# Altium schematic sheet Memory.SchDoc
size 209 x 297 mm; Author: Мурашкин Д.В.; Address1: Address1; Address2: Address2; Address3: Address3; Address4: Address4; DocumentNumber: SS19946-01; Scale: 1:1; Letter1Column: Э; PartName: Память ПЗУ
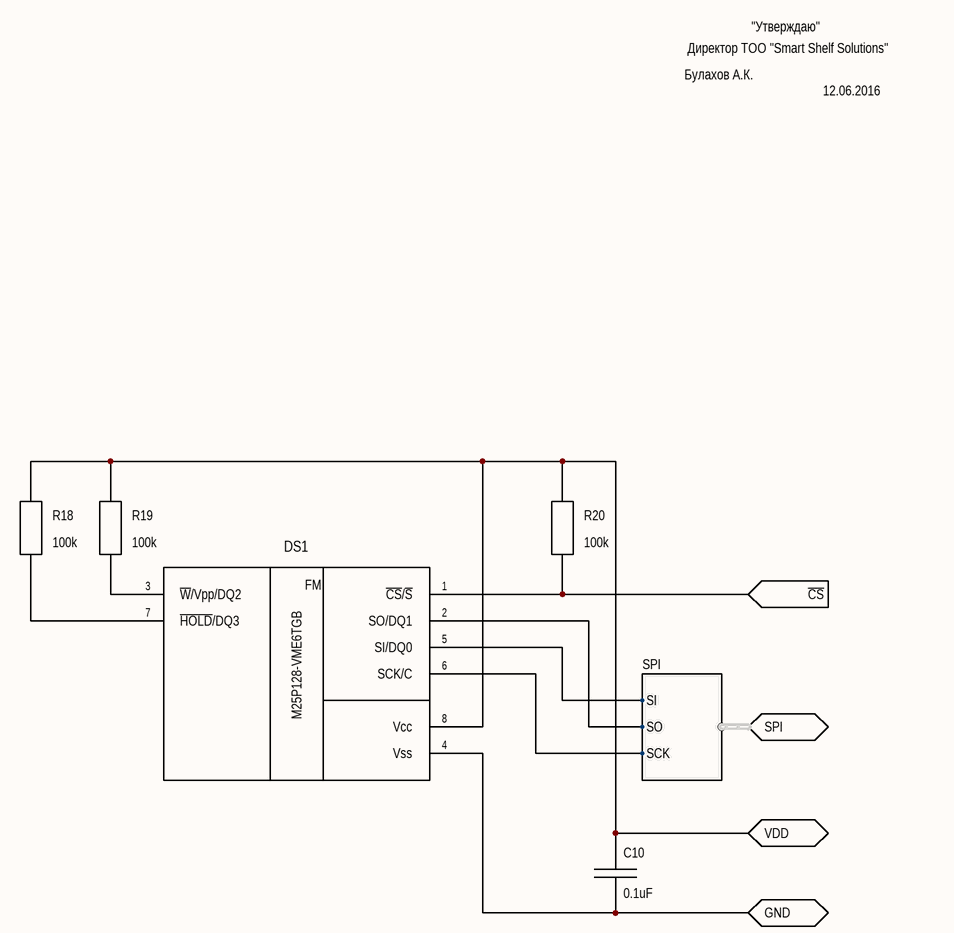
[diagram p0: Memory.SchDoc]

## Parts
C10  0.1uF  [CAPC1608L]
DS1  M25P128-VME6TGB  [VDFPN-8 (8x6)]
R18  100k  [RESC1608L]
R19  100k  [RESC1608L]
R20  100k  [RESC1608L]

## Ports
GND, SPI (harness SPI), VDD, ~{CS} (in)

## Harnesses
SPI: SI, SO, SCK

## Nets
~{CS}: DS1.1(~{CS}/~{S}) R20.2 ; port ~{CS}
GND: C10.2 DS1.4(Vss) ; port GND
VDD: C10.1 DS1.8(Vcc) R18.1 R19.1 R20.1 ; port VDD
NetDS1_2: DS1.2(SO/DQ1) ; port SPI.SO
NetDS1_3: DS1.3(~{W}/Vpp/DQ2) R19.2
NetDS1_5: DS1.5(SI/DQ0) ; port SPI.SI
NetDS1_6: DS1.6(SCK/C) ; port SPI.SCK
NetDS1_7: DS1.7(~{HOLD}/DQ3) R18.2

## Notes on the sheet
- Булахов А.К.
- "Утверждаю"
- Директор ТОО "Smart Shelf Solutions"
- 12.06.2016
- Перв. примен.
- Справ. №
- Подп. и дата
- Инв. № дубл.
- Взам. инв. №
- Разраб.
- Изм.
- Лист
- № докум.
- Подп.
- Дата
- Лит.
- Масса
- Масштаб
- Пров.
- Т.контр.
- Листов
- Инв. № подл.
- Утв.
- Н.контр.
- 2.106-A4
- Копировал
- Формат А4
- (in symbol M25P128-VME6TGB) FM

## Library data of the parts
C10 = CC0603KRX7R8BB104: Capacitor Ceramic 0.1uF 25V; Manufacturer: Yageo; Group: Ceramic Capacitors; Temperature Coefficient: X7R; Tolerance: ±10%; Short description: CAP CER 0.1UF 25V X7R 0603; Type: Ceramic; Part name: CC0603KRX7R8BB104; Voltage: 25 V; Package: 1608; Value: 0.1uF
DS1 = M25P128-VME6TGB: Memory Flash 128M (16M x 8); Manufacturer: Micron Technology; Short description: IC FLASH 128MBIT 54MHZ 8VDFPN; Package: 8-VDFN; Group: Memory; Part name: M25P128-VME6TGB
R18-R20 = RC0603JR-10100KL: Resistor Ceramic 100k 1608; Manufacturer: Yageo; Group: Resistors; Temperature Coefficient: ±100ppm/°C; Tolerance: ±5%; Power: 0.1W; Short description: RES SMD 100K OHM 5% 1/10W 0603; Part name: RC0603JR-10100KL; Type: Thin Film; Package: 1608; Value: 100k